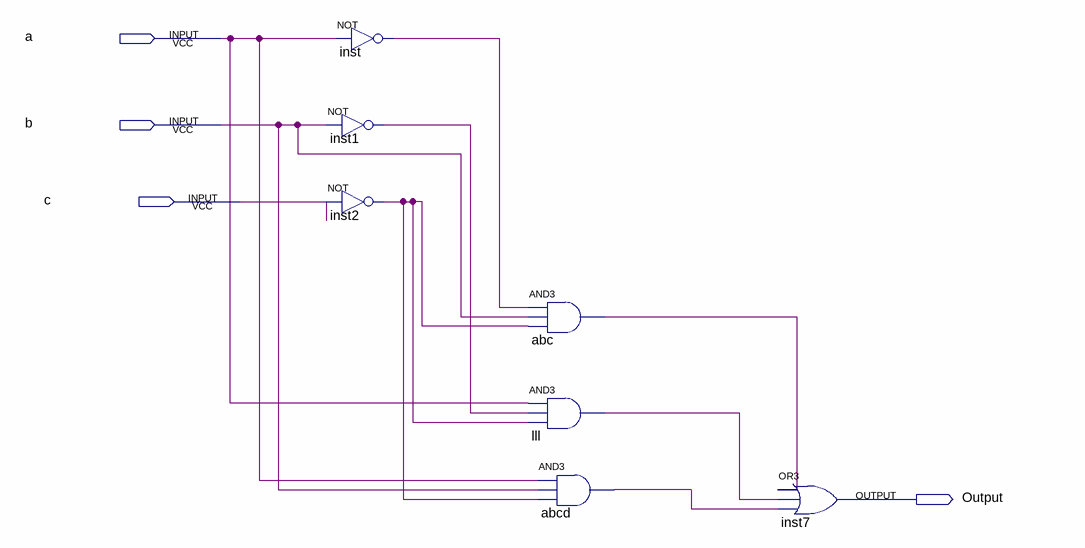
[diagram p0: schematic sheet]
// Quartus schematic lab2step1.bdf as structural Verilog: 7 symbols, 4 pins
module lab2step1 (
  input  a,
  input  b,
  input  c,
  output Output
);

  wire abc_out, abcd_out, inst1_out, inst2_out, inst_out, lll_out;

  not inst (inst_out, a);
  not inst1 (inst1_out, b);
  not inst2 (inst2_out, c);
  and abc (abc_out, inst_out, b, inst2_out);
  and lll (lll_out, a, inst1_out, inst2_out);
  and abcd (abcd_out, a, b, inst2_out);
  or inst7 (Output, abc_out, lll_out, abcd_out);
endmodule
